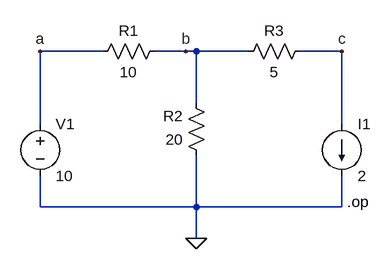
[diagram p0: schematic Circuit 1.asc]
Circuit 1.asc, the LTspice schematic file:
Version 4
SHEET 1 880 680
WIRE 128 32 32 32
WIRE 256 32 208 32
WIRE 272 32 256 32
WIRE 352 32 272 32
WIRE 496 32 432 32
WIRE 272 112 272 32
WIRE 32 144 32 32
WIRE 496 144 496 32
WIRE 32 272 32 224
WIRE 272 272 272 192
WIRE 272 272 32 272
WIRE 496 272 496 224
WIRE 496 272 272 272
WIRE 272 320 272 272
FLAG 272 320 0
FLAG 32 32 a
FLAG 256 32 b
FLAG 496 32 c
SYMBOL voltage 32 128 R0
SYMATTR InstName V1
SYMATTR Value 10
SYMBOL res 112 48 R270
WINDOW 0 32 56 VTop 2
WINDOW 3 0 56 VBottom 2
SYMATTR InstName R1
SYMATTR Value 10
SYMBOL res 336 48 R270
WINDOW 0 32 56 VTop 2
WINDOW 3 0 56 VBottom 2
SYMATTR InstName R3
SYMATTR Value 5
SYMBOL current 496 144 R0
SYMATTR InstName I1
SYMATTR Value 2
SYMBOL res 288 208 R180
WINDOW 0 36 76 Left 2
WINDOW 3 36 40 Left 2
SYMATTR InstName R2
SYMATTR Value 20
TEXT 504 264 Left 2 !.op

The netlist it stands for:
* Circuit 1.asc
V1 a 0 10
R1 a b 10
R3 b c 5
I1 c 0 2
R2 0 b 20
.op
.backanno
.end

* Results of the author's LTspice run, read from the files saved beside the schematic
* Operating Point:
*   V(a) = 10 V
*   V(b) = -6.667 V
*   V(c) = -16.67 V
*   I(I1) = 2 A
*   I(R1) = 1.667 A
*   I(R3) = 2 A
*   I(R2) = 333.3 mA
*   I(V1) = -1.667 A